# Altium schematic sheet Sheet1.SchDoc
size A4
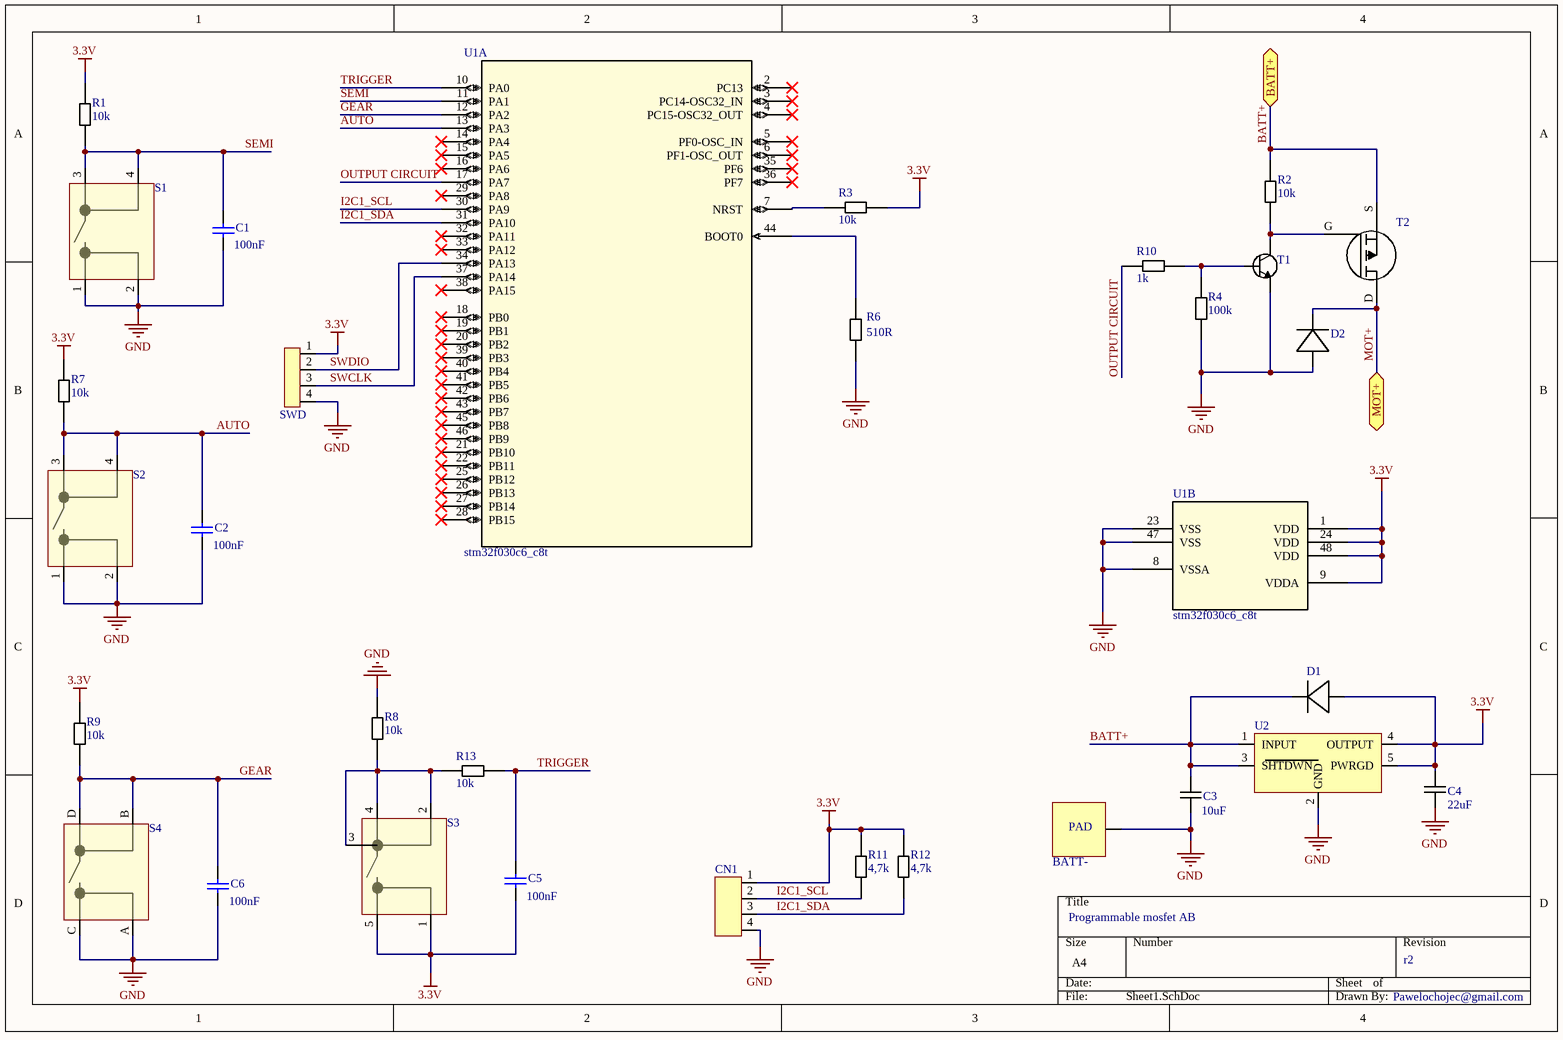
[diagram p0: Sheet1.SchDoc]

## Parts
C1  value 100nF  [C1206]  (hidden comment: Cap Semi)
C2  value 100nF  [C1206]  (hidden comment: Cap Semi)
C3  Capacitance: 10uF  [0805]  (hidden comment: CL21A106KOQNNNE)
C4  Capacitance: 22uF  [0805]  (hidden comment: CL21A226MQQNNNG)
C5  value 100nF  [C1206]  (hidden comment: Cap Semi)
C6  value 100nF  [C1206]  (hidden comment: Cap Semi)
CN1  501568-0407  [Molex 4x1]  (value not drawn)
CN3  BATT-  [PAD_1,5x0,8]
D1  TS4148RYG  [0805 diode]  (value not drawn)
D2  TS4148RYG  [0805 diode]  (value not drawn)
R1  value 10k  [PCBComponent_1]  (hidden comment: Resistor 0805)
R2  value 10k  [PCBComponent_1]  (hidden comment: Resistor 0805)
R3  value 10k  [PCBComponent_1]  (hidden comment: Resistor 0805)
R4  value 100k  [PCBComponent_1]  (hidden comment: Resistor 0805)
R6  value 510R  [PCBComponent_1]  (hidden comment: Resistor 0805)
R7  value 10k  [PCBComponent_1]  (hidden comment: Resistor 0805)
R8  value 10k  [PCBComponent_1]  (hidden comment: Resistor 0805)
R9  value 10k  [PCBComponent_1]  (hidden comment: Resistor 0805)
R10  value 1k  [PCBComponent_1]  (hidden comment: Resistor 0805)
R11  value 4,7k  [PCBComponent_1]  (hidden comment: Resistor 0805)
R12  value 4,7k  [PCBComponent_1]  (hidden comment: Resistor 0805)
R13  value 10k  [PCBComponent_1]  (hidden comment: Resistor 0805)
S1  HDT0004  [HDT0004]  (value not drawn)
S2  HDT0004  [HDT0004]  (value not drawn)
S3  KMS221GPLFS  [KMS221GLFS]  (value not drawn)
S4  HDP001L  [HDP001L]  (value not drawn)
SWD  3x1 pinout 1,27mm  [4x1 pinout 1,27mm]  (value not drawn)
T1  BC817W,115  [BC817W.115]  (value not drawn)
T2  PowerFLAT 5x6 P-CH Transistor  [PowerFLAT 5x6]  (value not drawn)
U1  stm32f030c6_c8t  [LQFP48-7x7mm]  (parts A,B of 2)
U2  MCP1755T-3302E/OT  [SOT 23-5, AP2127K-3.3TRG1]  (value not drawn)

## Ports
BATT+ (bidir), MOT+ (bidir)

## Nets
3.3V: C4.1(C) C5.1 CN1.1 D1.A(Anode) R1.2(D) R3.2(D) R7.2(D) R9.2(D) R11.2(D) R12.2(D) S3.1 S3.5 SWD.1 U1.1(VDD) U1.9(VDDA) U1.24(VDD) U1.48(VDD) U2.4(OUTPUT) U2.5(PWRGD)
GND: C1.1 C2.1 C3.2(C) C4.2(C) C6.1 CN1.4 CN3.1 D2.A(Anode) R4.1(D) R6.1(D) R8.2(D) S1.1 S1.2 S2.1 S2.2 S4.A S4.C SWD.4 T1.2(E) U1.8(VSSA) U1.23(VSS) U1.47(VSS) U2.2(GND)
AUTO: C2.2 R7.1(D) S2.3 S2.4 U1.13(PA3)
BATT+: C3.1(C) D1.K(Cathode) R2.2(D) T2.S U2.1(INPUT) U2.3(SHTDWN) ; port BATT+
GEAR: C6.2 R9.1(D) S4.B S4.D U1.12(PA2)
I2C1_SCL: CN1.2 R11.1(D) U1.30(PA9)
I2C1_SDA: CN1.3 R12.1(D) U1.31(PA10)
MOT+: D2.K(Cathode) T2.D ; port MOT+
OUTPUT CIRCUIT: R10.1(D) U1.17(PA7)
SEMI: C1.2 R1.1(D) S1.3 S1.4 U1.11(PA1)
SWCLK: SWD.3 U1.37(PA14)
SWDIO: SWD.2 U1.34(PA13)
TRIGGER: C5.2 R13.1(D) U1.10(PA0)
NetR2_1: R2.1(D) T1.3(C) T2.G
NetR3_1: R3.1(D) U1.7(NRST)
NetR4_2: R4.2(D) R10.2(D) T1.1(B)
NetR6_2: R6.2(D) U1.44(BOOT0)
NetR8_1: R8.1(D) R13.2(D) S3.2 S3.3 S3.4

Not connected (* = marked no-connect by the designer): U1 2(PC13)* 3(PC14-OSC32_IN)* 4(PC15-OSC32_OUT)* 5(PF0-OSC_IN)* 6(PF1-OSC_OUT)* 14(PA4)* 15(PA5)* 16(PA6)* 18(PB0)* 19(PB1)* 20(PB2)* 21(PB10)* 22(PB11)* 25(PB12)* 26(PB13)* 27(PB14)* 28(PB15)* 29(PA8)* 32(PA11)* 33(PA12)* 35(PF6)* 36(PF7)* 38(PA15)* 39(PB3)* 40(PB4)* 41(PB5)* 42(PB6)* 43(PB7)* 45(PB8)* 46(PB9)*

## Notes on the sheet
- Programmable mosfet AB
- r2
- Pawelochojec@gmail.com
- (in symbol PAD_1,5x0,8) PAD

## Library data of the parts
C1 C2 C5 C6 = Cap Semi: Capacitor (Semiconductor SIM Model); Published: 8-Jun-2000; LatestRevisionDate: 29-May-2009; LatestRevisionNote: IPC-7351 Footprint Added.; PackageReference: C1206; Publisher: Altium Limited; PackageDescription: Chip Capacitor
C3 = CL21A106KOQNNNE: Cap Ceramic 10uF 16V X5R 10% SMD 0805 85C T/R; Manufacturer: Samsung; Dielectric: X7R; Supplier 1: TME; Manufacturer Part Number: CL21A106KOQNNNE; Stock 1: 80000; Pricing 1: 100=0.02993, 300=0.02117, 1000=0.01541, 2000=0.01308, 10000=0.01253 (USD); Mount: Surface Mount; Case/Package: 0805; Case Code (Metric): 2012; Case Code (Imperial): 0805; Min Operating Temperature: -55°C; Max Operating Temperature: 85°C; Package Quantity: 1; Packaging: Tape and Reel; Tolerance: 10%; Voltage Rating: 16V; Voltage Rating (DC): 16V; Voltage: 16V; Length: 2mm; Height: 1.25mm; Width: 0.049inch; Thickness: 0.055inch; Depth: 1.25mm; Radiation Hardening: No; Lead Free: Lead Free; ComponentLink1URL: http://www.samsungsem.com/kr/support/product-search/mlcc/CL21A106KOQNNNE.jsp?src-supplier=Digi-Key; ComponentLink1Description: http://www.samsungsem.com/kr/support/product-search/mlcc/CL21A106KOQNNNE.jsp?src-supplier=Digi-Key; ComponentLink2URL: http://www1.futureelectronics.com/doc/SAMSUNG%20PASSIVE/CL05B104KQ5NNNC.pdf?src-supplier=Future+Electronics; ComponentLink2Description: http://www1.futureelectronics.com/doc/SAMSUNG%20PASSIVE/CL05B104KQ5NNNC.pdf?src-supplier=Future+Electronics; ComponentLink3URL: https://www.verical.com/server-webapp/html/getDatasheet?partID=358435&src-supplier=Verical; ComponentLink3Description: https://www.verical.com/server-webapp/html/getDatasheet?partID=358435&src-supplier=Verical; Supplier Part Number 1: CL21A106KOQNNNE
C4 = CL21A226MQQNNNG: Cap Ceramic 22uF 6.3V X5R 20% SMD 0805 85C Embossed T/R; Manufacturer: Samsung; Supplier 1: TME; Manufacturer Part Number: CL21A226MQQNNNG; Stock 1: 38100; Pricing 1: 100=0.03725, 300=0.0296, 1000=0.02317, 3000=0.01829, 12000=0.0174 (USD); Mount: Surface Mount; Case/Package: 0805; Case Code (Metric): 2012; Case Code (Imperial): 0805; Material: Ceramic; Min Operating Temperature: -55°C; Max Operating Temperature: 85°C; Tolerance: 20%; Dielectric: X5R; Packaging: Tape and Reel; Package Quantity: 3000; Voltage Rating: 6.3V; Voltage: 6.3V; Length: 2mm; Height: 1.25mm; Width: 0.049inch; Thickness: 0.055inch; Depth: 1.25mm; Radiation Hardening: No; ComponentLink1URL: http://www.samsungsem.com/kr/support/product-search/mlcc/CL21A226MQQNNNG.jsp?src-supplier=Digi-Key; ComponentLink1Description: http://www.samsungsem.com/kr/support/product-search/mlcc/CL21A226MQQNNNG.jsp?src-supplier=Digi-Key; ComponentLink2URL: https://produktinfo.conrad.com/datenblaetter/450000-474999/454647-da-01-en-VS_KONDENSATOR_0805.pdf?src-supplier=Conrad; ComponentLink2Description: https://produktinfo.conrad.com/datenblaetter/450000-474999/454647-da-01-en-VS_KONDENSATOR_0805.pdf?src-supplier=Conrad; Supplier Part Number 1: CL21A226MQQNNNG
CN1 = 501568-0407: Conn Shrouded Header HDR 4 POS 1mm Solder RA SMD Pico-Clasp™ T/R; Manufacturer: Molex; Current Rating: 1A; Voltage Rating (AC): 50V; Max Voltage Rating (DC): 5.05kV; Number of Positions: 4; Gender: Male; Connector Type: Male Pin; Glow Wire Compliant: Non-compliant; Supplier 1: TME; Manufacturer Part Number: 501568-0407; Stock 1: 1606; Pricing 1: 2=0.59, 20=0.53, 100=0.48, 500=0.42 (USD); Mount: Surface Mount; Contact Plating: Tin; Contact Material: Bronze,Brass; Color: Natural; Housing Color: Natural; Housing Material: Nylon; Min Operating Temperature: -40°C; Max Operating Temperature: 85°C; Number of Rows: 1; Package Quantity: 1700; Packaging: Tape and Reel; Voltage Rating: 50V; Termination: Solder; Fastening Type: Detent; Number of Contacts: 4; Max Voltage Rating (AC): 50V; Orientation: Right Angle; Number of Circuits: 4; Length: 6mm; Pitch: 1mm; Depth: 5.35mm; Radiation Hardening: No; REACH SVHC: Unknown; Lead Free: Lead Free; ComponentLink1URL: http://www.molex.com/webdocs/datasheets/pdf/en-us/5015680407_PCB_HEADERS.pdf?src-supplier=Mouser; ComponentLink1Description: http://www.molex.com/webdocs/datasheets/pdf/en-us/5015680407_PCB_HEADERS.pdf?src-supplier=Mouser; ComponentLink2URL: http://www.onlinecomponents.com/productFiles/mf-MOL/940865015680407_pcb_headers.pdf?src-supplier=Onlinecomponents.com; ComponentLink2Description: http://www.onlinecomponents.com/productFiles/mf-MOL/940865015680407_pcb_headers.pdf?src-supplier=Onlinecomponents.com; ComponentLink3URL: http://www.molex.com/webdocs/datasheets/pdf/en-us/5015680407_PCB_HEADERS.pdf?src-supplier=Avnet; ComponentLink3Description: http://www.molex.com/webdocs/datasheets/pdf/en-us/5015680407_PCB_HEADERS.pdf?src-supplier=Avnet; ComponentLink4URL: https://www.molex.com/pdm_docs/ps/PS-501568-001.pdf?src-supplier=Digi-Key; ComponentLink4Description: https://www.molex.com/pdm_docs/ps/PS-501568-001.pdf?src-supplier=Digi-Key; ComponentLink5URL: http://uk.rs-online.com/webdocs/13c5/0900766b813c54a0.pdf?src-supplier=RSComponents; ComponentLink5Description: http://uk.rs-online.com/webdocs/13c5/0900766b813c54a0.pdf?src-supplier=RSComponents; ComponentLink6URL: http://www.molex.com/webdocs/datasheets/pdf/en-us/5015680407_PCB_HEADERS.pdf?src-supplier=Avnet+Europe; ComponentLink6Description: http://www.molex.com/webdocs/datasheets/pdf/en-us/5015680407_PCB_HEADERS.pdf?src-supplier=Avnet+Europe; Supplier Part Number 1: MX-501568-0407
CN3 = PAD_1,5x0,8
D1 D2 = TS4148RYG: Diode Small Signal Switching 75V 0.15A 2-Pin Case 0805 T/R; Manufacturer: Taiwan Semiconductor; Forward Voltage: 1V; Peak Non-Repetitive Surge Current: 2A; Element Configuration: Single; Reverse Recovery Time: 4ns; Supplier 1: TME; Manufacturer Part Number: TS4148RYG; Stock 1: 145631; Pricing 1: 25=0.0275, 100=0.018, 500=0.0144, 1000=0.0129, 5000=0.012 (USD); Mount: Surface Mount; Case/Package: SMD/SMT; Number of Pins: 2; Min Operating Temperature: -65°C; Max Operating Temperature: 175°C; Packaging: Tape and Reel; Max Repetitive Reverse Voltage (Vrrm): 75V; Max Forward Surge Current (Ifsm): 2A; Radiation Hardening: No; ComponentLink1URL: http://www.rapidonline.com/pdf/47-1004.pdf?src-supplier=Rapid+Electronics; ComponentLink1Description: http://www.rapidonline.com/pdf/47-1004.pdf?src-supplier=Rapid+Electronics; ComponentLink2URL: https://www.verical.com/server-webapp/html/getDatasheet?partID=461722&src-supplier=Verical; ComponentLink2Description: https://www.verical.com/server-webapp/html/getDatasheet?partID=461722&src-supplier=Verical; Supplier Part Number 1: TS4148-RYG
R1-R4 R6-R13 = 0805S8F1000T5E: Resistor: thick film; SMD; 0805; 100O; 0.125W; ±1%; -55÷125°C; Manufacturer: Royal Electronic Factory; Supplier 1: TME; Manufacturer Part Number: 0805S8F1000T5E; Stock 1: 100000; Pricing 1: 5000=0.00537, 50000=0.00395, 200000=0.0037 (USD); Supplier Part Number 1: 0805S8F1000T5E
S1 S2 = HDT0004: SWITCH DETECT MICRO SPST SMD 5V; Manufacturer: ITT C&K; Mechanical Life: 100000Cycles; Operating Force: 0.34N; Contact Resistance: 500mR; Current Rating: 1mA; Pretravel: 0.012inch; Overtravel: 0.039inch; Operating Position: 0.138inch; Switch Function: Off-Mom; Actuator Type: Lever; Actuator Length: 1.5mm; Supplier 1: TME; Manufacturer Part Number: HDT0004; Stock 1: 2654; Pricing 1: 1=0.9131, 5=0.8114, 20=0.7611, 100=0.7108, 500=0.6851 (USD); Mount: Surface Mount; Case/Package: SMD/SMT; Contact Material: Bronze,Silver; Number of Terminals: 4; Min Operating Temperature: -40°C; Max Operating Temperature: 85°C; Packaging: Tape and Reel; Package Quantity: 1; Voltage Rating (DC): 5V; Throw Configuration: SPST; Max Voltage Rating (DC): 5V; Termination: SMD/SMT; Electrical Life: 100000Cycles; Contact Current Rating: 1mA; Orientation: Straight; Height: 2.3mm; Width: 3.8mm; REACH SVHC: No SVHC; Lead Free: Lead Free; ComponentLink1URL: http://www.farnell.com/datasheets/1707717.pdf?src-supplier=Element14; ComponentLink1Description: http://www.farnell.com/datasheets/1707717.pdf?src-supplier=Element14; ComponentLink2URL: http://www.ck-components.com/index.php?module=media&action=Display&cmpref=15147&lang=en&width=&height=&format=&alt=&src-supplier=Digi-Key; ComponentLink2Description: http://www.ck-components.com/index.php?module=media&action=Display&cmpref=15147&lang=en&width=&height=&format=&alt=&src-supplier=Digi-Key; ComponentLink3URL: https://www.ckswitches.com/media/1307/hdt.pdf?src-supplier=Digi-Key; ComponentLink3Description: https://www.ckswitches.com/media/1307/hdt.pdf?src-supplier=Digi-Key; Supplier Part Number 1: HDT0004
S3 = KMS221GPLFS: SWITCH TACTILE SPST-NO 0.05A 50V; Manufacturer: ITT C&K; Mechanical Life: 100000Cycles; Operating Force: 2N; Throw Configuration: SPST; Max Current Rating: 50mA; Max Voltage Rating (DC): 32V; Illumination Type: Non-Illuminated; Switch Travel: 0.25mm; Switch Function: Off-Mom; Power Rating: 1W; Actuator Length: 0.75mm; Ratings: IP40; Supplier 1: TME; Manufacturer Part Number: KMS221GPLFS; Stock 1: 0; Mount: Surface Mount; Contact Material: Silver; Contact Plating: Silver; Min Operating Temperature: -40°C; Max Operating Temperature: 85°C; Termination: Gull Wing; Packaging: Tape and Reel; Voltage Rating (DC): 32V; Package Quantity: 1; Current Rating: 50mA; Orientation: Right Angle; Contact Current Rating: 50mA; Length: 3.55mm; Depth: 4.6mm; Width: 1.42mm; Radiation Hardening: No; Lead Free: Lead Free; ComponentLink1URL: http://www.ck-components.com/index.php?module=media&action=Display&cmpref=14416&lang=en&width=&height=&format=&alt=&src-supplier=Digi-Key; ComponentLink1Description: http://www.ck-components.com/index.php?module=media&action=Display&cmpref=14416&lang=en&width=&height=&format=&alt=&src-supplier=Digi-Key; ComponentLink2URL: http://www.ck-components.com/14416/kms_31aug10.pdf/?src-supplier=Mouser; ComponentLink2Description: http://www.ck-components.com/14416/kms_31aug10.pdf/?src-supplier=Mouser; ComponentLink3URL: https://www.ckswitches.com/media/1482/kms.pdf?src-supplier=Digi-Key; ComponentLink3Description: https://www.ckswitches.com/media/1482/kms.pdf?src-supplier=Digi-Key; Supplier Part Number 1: KMS221GPLFS
T1 = BC817W,115: TRANS NPN 45V 0.5A SOT323; Manufacturer: Nexperia USA; Supplier 1: Farnell; Manufacturer Part Number: BC817W,115; Stock 1: 0; Supplier Part Number 1: 2439014
T2 = STL42P6LLF6: MOSFET P-CH 60V 42A 8POWERFLAT; Manufacturer: STMicroelectronics; Rds On Max: 26mR; Input Capacitance: 3.78nF; Max Power Dissipation: 100W; Drain to Source Resistance: 34mR; Turn-Off Delay Time: 171ns; Turn-On Delay Time: 51.4ns; Element Configuration: Single; Gate to Source Voltage (Vgs): 20V; Supplier 1: TME; Manufacturer Part Number: STL42P6LLF6; Stock 1: 0; Pricing 1: 1=1.13, 5=1.02, 25=0.89, 100=0.8 (USD); Mount: Surface Mount; Number of Pins: 8; Max Operating Temperature: 175°C; Packaging: Tape and Reel; Drain to Source Voltage (Vdss): 60V; Continuous Drain Current (ID): 42A; Length: 6.35mm; Height: 0.95mm; Width: 5.4mm; Lead Free: Lead Free; Supplier Part Number 1: STL42P6LLF6
U1 = STM32F030C6_C8T: No Description Available; Vendor: STMicroelectronics; Copyright: Copyright (C) 2016 Accelerated Designs. All rights reserved; Manufacturer_Part_Number: stm32f030c6_c8t; RefDes: RefDes; Type: DEV; Value: Value
U2 = MCP1755T-3302E/OT: MICROCHIP   MCP1755T-3302E/OT   IC, LDO VOLT REG, 3.3V, 0.3A, SOT23-5; Max Input Voltage: 16V; Output Current: 300mA; Dropout Voltage: 300mV; Number of Regulators: 1; Quiescent Current: 100uA; Power Supply Rejection Ratio (PSRR): 80dB; Output Type: Fixed; Min Input Voltage: 3.6V; Tolerance: 2%; Polarity: Positive; Nominal Supply Current: 68uA; Supplier 1: TME; Manufacturer: Microchip; Manufacturer Part Number: MCP1755T-3302E/OT; Stock 1: 13; Pricing 1: 3=0.75, 10=0.73, 25=0.62, 100=0.57 (USD); Mount: Surface Mount; Case/Package: SOT-23-5; Number of Pins: 5; Min Operating Temperature: -40°C; Max Operating Temperature: 125°C; Packaging: Tape and Reel; Number of Outputs: 1; Output Voltage: 3.3V; Package Quantity: 3000; Nominal Output Voltage: 3.3V; Max Output Current: 300mA; Accuracy: 2%; Output Voltage Accuracy: 2%; Radiation Hardening: No; REACH SVHC: No SVHC; Lead Free: Lead Free; ComponentLink1URL: http://www.microchip.com/mymicrochip/filehandler.aspx?ddocname=en533805&src-supplier=Digi-Key; ComponentLink1Description: http://www.microchip.com/mymicrochip/filehandler.aspx?ddocname=en533805&src-supplier=Digi-Key; ComponentLink2URL: http://www.microchip.com/mymicrochip/filehandler.aspx?ddocname=en560605&src-supplier=Digi-Key; ComponentLink2Description: http://www.microchip.com/mymicrochip/filehandler.aspx?ddocname=en560605&src-supplier=Digi-Key; ComponentLink3URL: http://www.farnell.com/datasheets/1697992.pdf?src-supplier=Element14; ComponentLink3Description: http://www.farnell.com/datasheets/1697992.pdf?src-supplier=Element14; ComponentLink4URL: https://www.verical.com/server-webapp/html/getDatasheet?partID=775879&src-supplier=Verical; ComponentLink4Description: https://www.verical.com/server-webapp/html/getDatasheet?partID=775879&src-supplier=Verical; Supplier Part Number 1: MCP1755T-3302E/OT